# Altium schematic sheet Inputs_Outputs.SchDoc
size A4; SheetNumber: 4; SheetTotal: 4
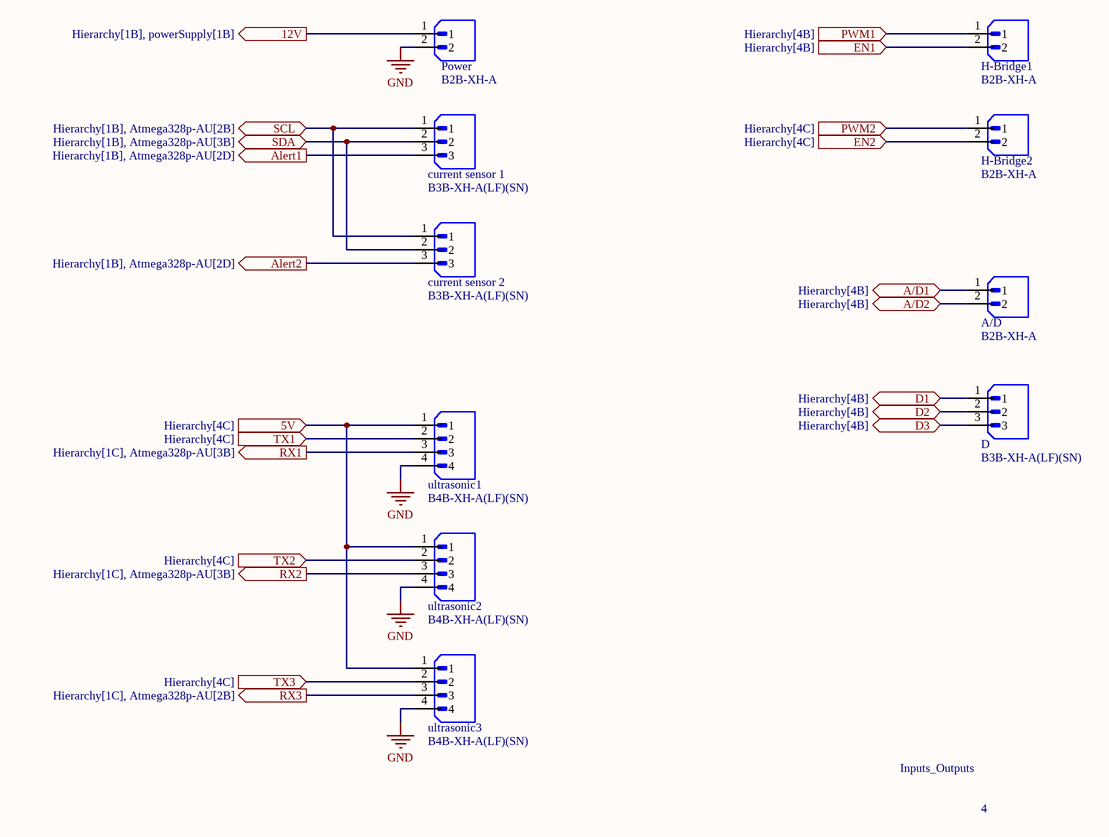
[diagram p0: Inputs_Outputs.SchDoc]

## Parts
A/D  B2B-XH-A  [JST_B2B-XH-A]
current_sensor_1  B3B-XH-A(LF)(SN)  [JST_B3B-XH-A(LF)(SN)]
current_sensor_2  B3B-XH-A(LF)(SN)  [JST_B3B-XH-A(LF)(SN)]
D  B3B-XH-A(LF)(SN)  [JST_B3B-XH-A(LF)(SN)]
H-Bridge1  B2B-XH-A  [JST_B2B-XH-A]
H-Bridge2  B2B-XH-A  [JST_B2B-XH-A]
Power  B2B-XH-A  [JST_B2B-XH-A]
ultrasonic1  B4B-XH-A(LF)(SN)  [JST_B4B-XH-A(LF)(SN)]
ultrasonic2  B4B-XH-A(LF)(SN)  [JST_B4B-XH-A(LF)(SN)]
ultrasonic3  B4B-XH-A(LF)(SN)  [JST_B4B-XH-A(LF)(SN)]

## Ports
5V (in, see Hierarchy[4C]), 12V (out, see Hierarchy[1B], powerSupply[1B]), A/D1 (bidir, see Hierarchy[4B]), A/D2 (bidir, see Hierarchy[4B]), Alert1 (out, see Hierarchy[1B], Atmega328p-AU[2D]), Alert2 (out, see Hierarchy[1B], Atmega328p-AU[2D]), D1 (bidir, see Hierarchy[4B]), D2 (bidir, see Hierarchy[4B]), D3 (bidir, see Hierarchy[4B]), EN1 (in, see Hierarchy[4B]), EN2 (in, see Hierarchy[4C]), PWM1 (in, see Hierarchy[4B]), PWM2 (in, see Hierarchy[4C]), RX1 (out, see Hierarchy[1C], Atmega328p-AU[3B]), RX2 (out, see Hierarchy[1C], Atmega328p-AU[3B]), RX3 (out, see Hierarchy[1C], Atmega328p-AU[2B]), SCL (bidir, see Hierarchy[1B], Atmega328p-AU[2B]), SDA (bidir, see Hierarchy[1B], Atmega328p-AU[3B]), TX1 (in, see Hierarchy[4C]), TX2 (in, see Hierarchy[4C]), TX3 (in, see Hierarchy[4C])

## Nets
GND: Power.2 ultrasonic1.4 ultrasonic2.4 ultrasonic3.4
5V: ultrasonic1.1 ultrasonic2.1 ultrasonic3.1 ; port 5V
12V: Power.1 ; port 12V
A/D1: A/D.1 ; port A/D1
A/D2: A/D.2 ; port A/D2
Alert1: current_sensor_1.3 ; port Alert1
Alert2: current_sensor_2.3 ; port Alert2
D1: D.1 ; port D1
D2: D.2 ; port D2
D3: D.3 ; port D3
EN1: H-Bridge1.2 ; port EN1
EN2: H-Bridge2.2 ; port EN2
PWM1: H-Bridge1.1 ; port PWM1
PWM2: H-Bridge2.1 ; port PWM2
RX1: ultrasonic1.3 ; port RX1
RX2: ultrasonic2.3 ; port RX2
RX3: ultrasonic3.3 ; port RX3
SCL: current_sensor_1.1 current_sensor_2.1 ; port SCL
SDA: current_sensor_1.2 current_sensor_2.2 ; port SDA
TX1: ultrasonic1.2 ; port TX1
TX2: ultrasonic2.2 ; port TX2
TX3: ultrasonic3.2 ; port TX3

## Notes on the sheet
- Inputs_Outputs
- 4

## Library data of the parts
A/D H-Bridge1 H-Bridge2 Power = B2B-XH-A: MF: {'manufacturer': u'JST Sales America Inc.'}; Package: None; Price: None; Value: *; MP: B2B-XH-A; Availability: Unavailable
current_sensor_1 current_sensor_2 D = B3B-XH-A(LF)(SN): Connector Header Through Hole 3 position 0.098 (2.50mm); MF: JST Sales; SnapEDA_Link: https://www.snapeda.com/parts/B3B-XH-A(LF)(SN)/JST+Sales+America+Inc./view-part/?ref=snap; Package: None; Value: *; MP: B3B-XH-A(LF)(SN); Check_prices: https://www.snapeda.com/parts/B3B-XH-A(LF)(SN)/JST+Sales+America+Inc./view-part/?ref=eda
ultrasonic1-ultrasonic3 = B4B-XH-A(LF)(SN): Connector Header Through Hole 4 position 0.098 (2.50mm); MF: JST Sales; SnapEDA_Link: https://www.snapeda.com/parts/B4B-XH-A(LF)(SN)/JST+Sales+America+Inc./view-part/?ref=snap; Package: None; Value: *; MP: B4B-XH-A(LF)(SN); Check_prices: https://www.snapeda.com/parts/B4B-XH-A(LF)(SN)/JST+Sales+America+Inc./view-part/?ref=eda